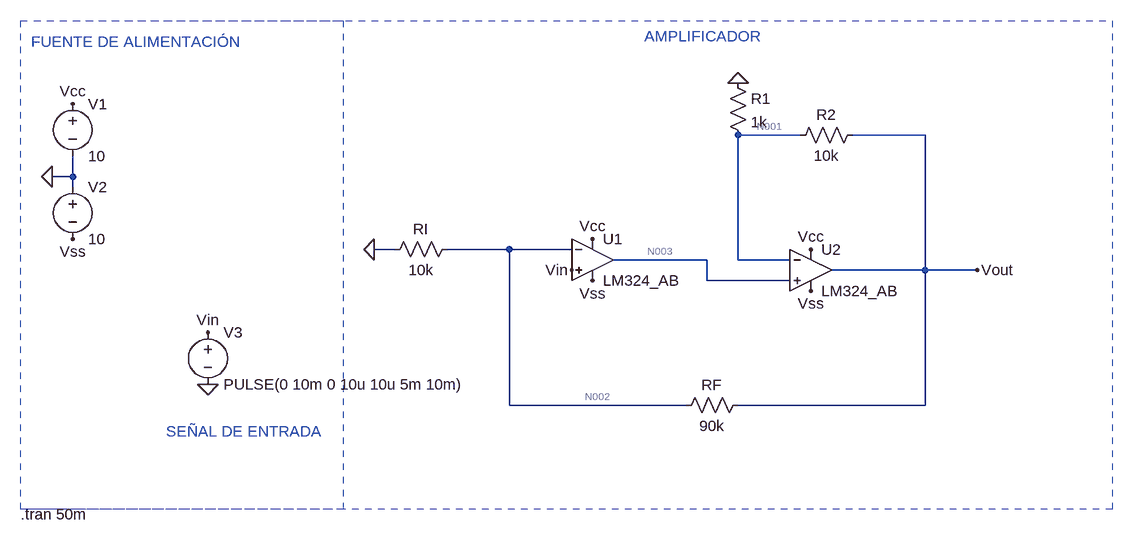
[diagram p0: schematic amp_vfa_vfa.asc]
* amp_vfa_vfa.asc
RF Vout N002 90k
RI N002 0 10k
V1 Vcc 0 10
V2 0 Vss 10
V3 Vin 0 PULSE(0 10m 0 10u 10u 5m 10m)
R2 Vout N001 10k
R1 0 N001 1k
* U1: LM324_AB (symbol ZZZ\OpAmp\LM324_AB not available, pins judged from their places): In+=Vin In-=N002 V+=Vcc V-=Vss OUT=N003
* U2: LM324_AB (symbol ZZZ\OpAmp\LM324_AB not available, pins judged from their places): In+=N003 In-=N001 V+=Vcc V-=Vss OUT=Vout
* AMPLIFICADOR
* FUENTE DE ALIMENTACIÓN
* SEÑAL DE ENTRADA
.tran 50m
.backanno
.end

* Results of the author's LTspice run, read from the files saved beside the schematic
* Operating Point, zero values left out:
*   V(vout) = -4.449 mV
*   V(n002) = -41.52 µV
*   V(vcc) = 10 V
*   V(vss) = -10 V
*   V(n001) = -363.7 µV
*   V(n003) = -322.2 µV
*   I(R1) = 363.7 nA
*   I(R2) = -408.5 nA
*   I(Ri) = -4.152 nA
*   I(Rf) = -48.97 nA
*   I(V3) = 43.57 nA
*   I(V2) = -717.7 µA
*   I(V1) = -717.4 µA
*   Ix(u1:IN+) = -43.57 nA
*   Ix(u1:IN-) = -44.81 nA
*   Ix(u1:VCC) = 358.9 µA
*   Ix(u1:VSS) = -358.9 µA
*   Ix(u1:OUT) = 43.57 nA
*   Ix(u2:IN+) = -43.57 nA
*   Ix(u2:IN-) = -44.82 nA
*   Ix(u2:VCC) = 358.5 µA
*   Ix(u2:VSS) = -358.9 µA
*   Ix(u2:OUT) = 457.5 nA
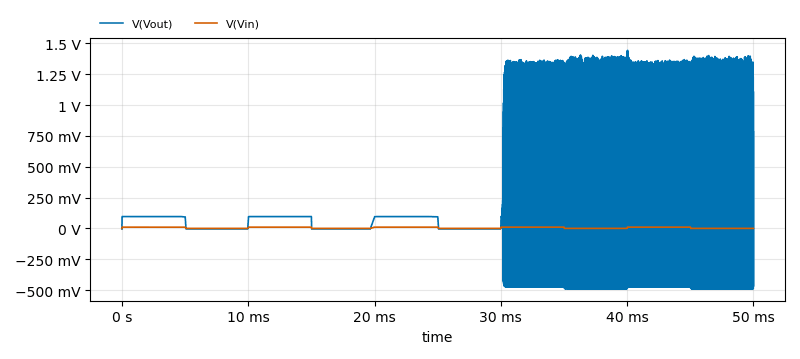
[diagram p1: Transient Analysis of amp_vfa_vfa.asc, plotted from the saved traces]
* Transient Analysis, 1 run:
*   V(Vout): min -490 mV, max 1.508 V, average 67.93 mV, rms 394.5 mV, last -304.9 mV
*   V(Vin): min 0 V, max 10 mV, average 5.01 mV, rms 7.076 mV, last 0 V